# EAGLE design easyMySens-Std-V02-v035 (EAGLE 7.6.0)
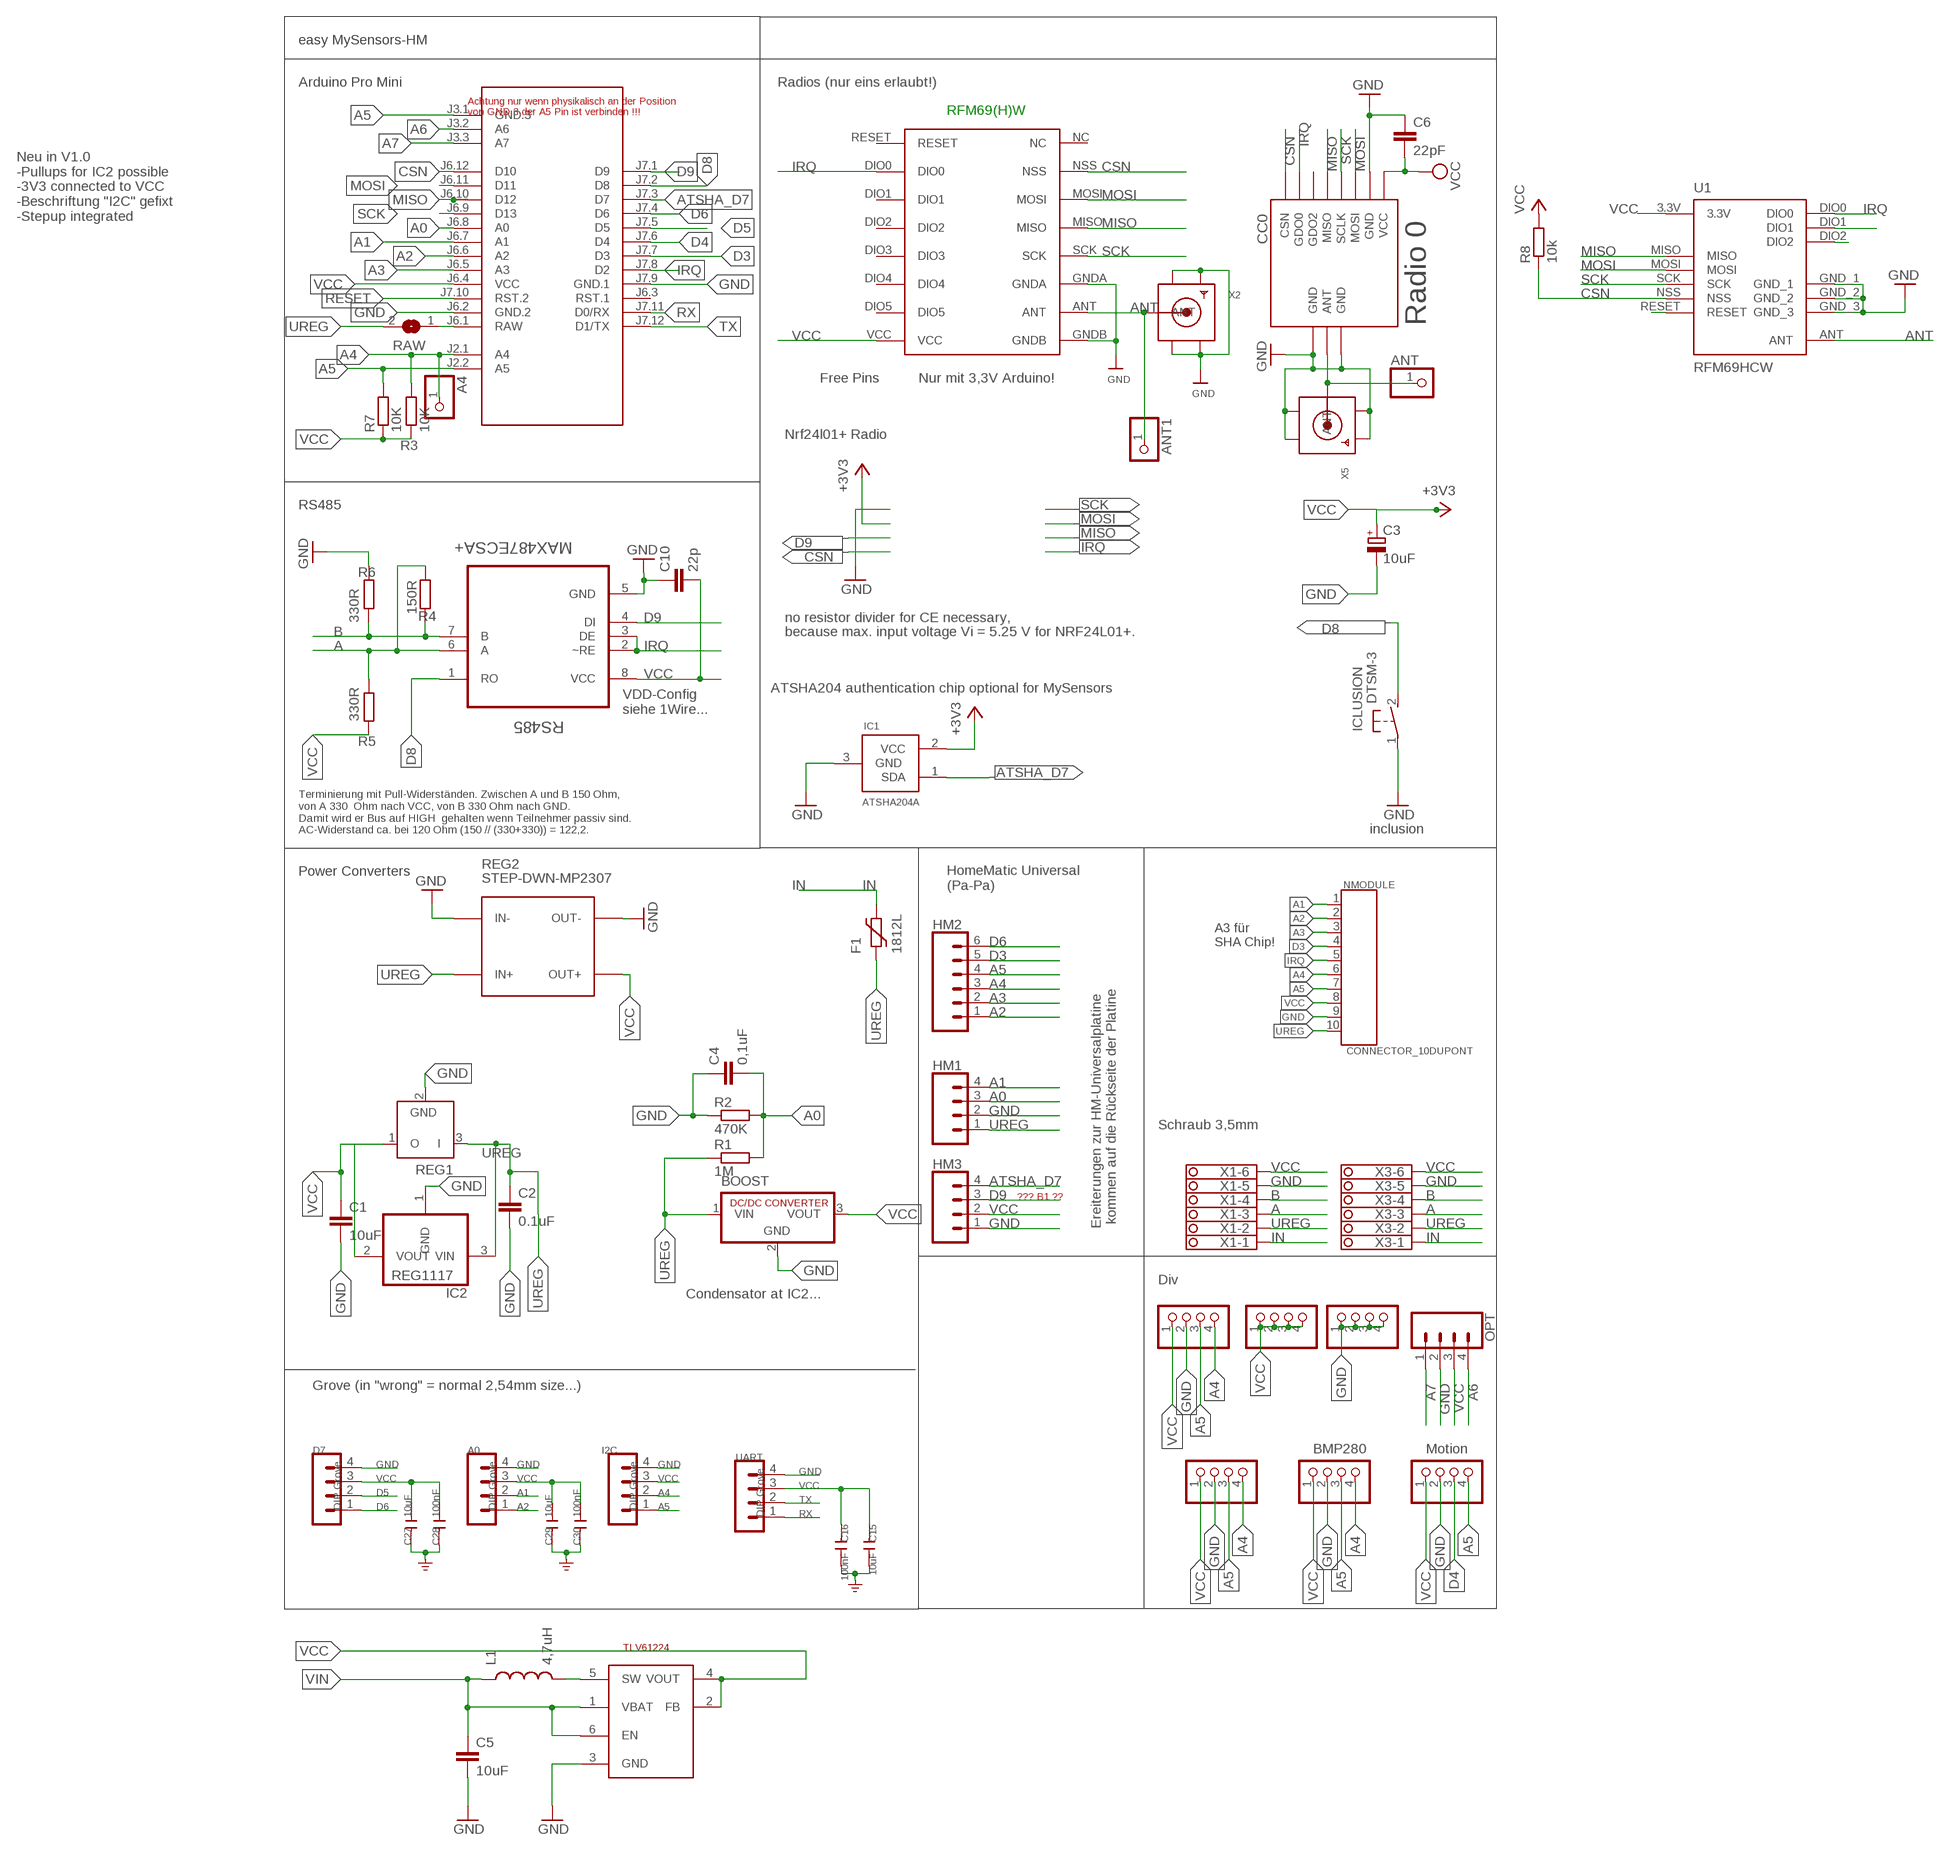
[diagram p0: schematic, sheet 1]

## Parts
A0  DIP Grove  MA04-1  [MA04-1]
A4  PINHD-1X1  [1X01]
ANT  PINHD-1X1  [1X01]
ANT1  PINHD-1X1  [1X01]
BH1750  PINHD-1X04_2.54-S  [1X04-S]
BOOST  R-78C1.8-1.0  [SIP3]
C1  10uF  C-EUC1210  [C1210]
C2  0.1uF  C-EUC1206  [C1206]
C3  10uF  CPOL-EUSMCC  [SMC_C]
C4  0,1uF  C-EUC1206  [C1206]
C5  10uF  CAP0805  [0805]
C6  22pF  C-EUC0805  [C0805]
C10  22p  C-EUC0805  [C0805]
C15  10uF  CAP-0603  [C0603]
C16  100nF  CAP-0603  [C0603]
C27  10uF  CAP-0603  [C0603]
C28  100nF  CAP-0603  [C0603]
C29  10uF  CAP-0603  [C0603]
C30  100nF  CAP-0603  [C0603]
CC0  CC1101  CC1101_MODULE1SMD  [CC1101_MODULE1_SMD]
D7  DIP Grove  MA04-1  [MA04-1]
F1  1812L  [1812L]
HM1  CONN_04  [1X04]
HM2  CONN_06SILK_FEMALE_PTH  [1X06]
HM3  CONN_04  [1X04]
I2C-1  PINHD-1X04_2.54-S  [1X04-S]
I2C-2  PINHD-1X04_2.54-S  [1X04-S]
I2C.  DIP Grove  MA04-1  [MA04-1]
IC1  ATSHA204A  [SOT23]
IC2  REG1117  [SOT223]
ICLUSION  DTSM-3  [DTSM-3]
JP1  PINHD-1X04_2.54-S  [1X04-S]
JP3  PINHD-1X04_2.54-S  [1X04-S]
L1  4,7uH  INDUCTOR0805  [0805]
M1  ARDUINO-PRO-MINI-3.3V#NP  [ARDUINO-PRO-MINI#NP]
MOTION  PINHD-1X04_2.54-S  [1X04-S]
NMODULE  CONNECTOR_10DUPONT  [DUPONT_10]
OPT  CONN_04  [1X04]
R1  1M  R-EU_R0805  [R0805]
R2  470K  R-EU_R0805  [R0805]
R3  10K  R-EU_R0805  [R0805]
R4  150R  R-EU_R0805  [R0805]
R5  330R  R-EU_R0805  [R0805]
R6  330R  R-EU_R0805  [R0805]
R7  10K  R-EU_R0805  [R0805]
R8  10k  R-EU_M0805  [M0805]
RAW  SJ  [SJ]
REG1  LP2950Z  [TO92]
REG2  STEP-DWN-MP2307  DC-DC-STEP-DOWN-MP2307  [DC-DC-STEP-DOWN-MP2307]
RFM69W  RFM69HW  [RFM]
RS485  MAX487ECSA+  [SOIC127P600X175-8N]
STEPUP  TLV61224  TI-TLV61224  [SOT23-6L]
U1  RFM69HCW  [RFM69HCW-XXXS2]
UART  DIP Grove  MA04-1  [MA04-1]
X1  1751280  [1751280]
X2  SMACONNECTOR_EDGE  [SMA_EDGELAUNCH]
X3  1751280  [1751280]
X5  SMACONNECTOR_EDGE  [SMA_EDGELAUNCH]

## Nets
3.3V [Power]: IC1.2(VCC) ; supply symbol labelled +3V3
A: R4.1 R5.2 RS485.6(A) X1.3 X3.3
A0: C4.2 HM1.3 M1.J6.8(A0) R1.2 R2.2
A1: A0.2 HM1.4 M1.J6.7(A1) NMODULE.1
A2: A0.1 HM2.1 M1.J6.6(A2) NMODULE.2
A3: HM2.2 M1.J6.5(A3) NMODULE.3
A4: A4.1 BH1750.4 HM2.3 I2C-1.4 I2C-2.4 I2C..2 M1.J2.1(A4) NMODULE.6 R3.2
A5: BH1750.3 HM2.4 I2C-1.3 I2C-2.3 I2C..1 M1.J2.2(A5) M1.J3.1(GND.3) MOTION.4 NMODULE.7 R7.2
A6: M1.J3.2(A6) OPT.4
A7: M1.J3.3(A7) OPT.1
ANT: ANT1.1 RFM69W.ANT U1.ANT X2.P(ANT)
ANT0: ANT.1 CC0.ANT X5.P(ANT)
ATSHA_D7: HM3.4 IC1.1(SDA) M1.J7.3(D7)
B: R4.2 R6.1 RS485.7(B) X1.4 X3.4
CSN: CC0.CSN M1.J6.12(D10) R8.1 RFM69W.NSS U1.NSS
D3: HM2.5 M1.J7.7(D3) NMODULE.4
D4: M1.J7.6(D4) MOTION.3
D5: D7.2 M1.J7.5(D5)
D6: D7.1 HM2.6 M1.J7.4(D6)
D8: ICLUSION.2 M1.J7.2(D8) RS485.1(RO)
D9: HM3.3 M1.J7.1(D9) RS485.4(DI)
GND [Power]: A0.4 BH1750.2 BOOST.2(GND) C1.2 C2.2 C3.- C4.1 C5.2 C6.1 C10.1 C15.1 C16.1 C27.2 C28.2 C29.2 C30.2 CC0.GND@0(GND) CC0.GND@1(GND) CC0.GND@2(GND) D7.4 HM1.2 HM3.1 I2C-1.2 I2C-2.2 I2C..4 IC1.3(GND) IC2.1(GND) ICLUSION.1 JP1.1 JP1.2 JP1.3 JP1.4 M1.J6.2(GND.2) M1.J7.9(GND.1) MOTION.2 NMODULE.9 OPT.2 R2.1 R6.2 REG1.2(GND) REG2.IN- REG2.OUT- RFM69W.GNDA RFM69W.GNDB RS485.5(GND) STEPUP.3(GND) U1.GND_1 U1.GND_2 U1.GND_3 UART.4 X1.5 X2.GND@1(GND4) X2.GND@2(GND3) X2.GND@3(GND2) X2.GND@4(GND1) X3.5 X5.GND@1(GND4) X5.GND@2(GND3) X5.GND@3(GND2) X5.GND@4(GND1) ; supply symbol labelled GND_POWER
IN [Power]: F1.P$2 X1.1 X3.1
IRQ: CC0.GDO0 M1.J7.8(D2) NMODULE.5 RFM69W.DIO0 RS485.2(~RE) RS485.3(DE) U1.DIO0
MISO: CC0.MISO M1.J6.10(D12) RFM69W.MISO U1.MISO
MOSI: CC0.MOSI M1.J6.11(D11) RFM69W.MOSI U1.MOSI
N$1: U1.RESET
N$13: L1.2 STEPUP.5(SW)
N$14: U1.DIO2
N$15: U1.DIO1
RAW [Power]: M1.J6.1(RAW) RAW.1
RESET: M1.J7.10(RST.2)
RX: M1.J7.11(D0/RX) UART.1
SCK: CC0.SCLK M1.J6.9(D13) RFM69W.SCK U1.SCK
TX: M1.J7.12(D1/TX) UART.2
UREG [Power]: BOOST.1(VIN) C2.1 F1.P$1 HM1.1 IC2.3(VIN) NMODULE.10 R1.1 RAW.2 REG1.3(I) REG2.IN+ X1.2 X3.2
VCC [Power]: A0.3 BH1750.1 BOOST.3(VOUT) C1.1 C3.+ C6.2 C10.2 C15.2 C16.2 C27.1 C28.1 C29.1 C30.1 CC0.VCC D7.3 HM3.2 I2C-1.1 I2C-2.1 I2C..3 IC2.2(VOUT) JP3.1 JP3.2 JP3.3 JP3.4 M1.J6.4(VCC) MOTION.1 NMODULE.8 OPT.3 R3.1 R5.1 R7.1 R8.2 REG1.1(O) REG2.OUT+ RFM69W.VCC RS485.8(VCC) STEPUP.2(FB) STEPUP.4(VOUT) U1.3.3V UART.3 X1.6 X3.6 ; supply symbol labelled +3V3
VIN: C5.1 L1.1 STEPUP.1(VBAT) STEPUP.6(EN)
Unconnected: CC0.GDO2 M1.J6.3(RST.1) RFM69W.DIO1 RFM69W.DIO2 RFM69W.DIO3 RFM69W.DIO4 RFM69W.DIO5 RFM69W.NC RFM69W.RESET

## Notes on the sheet
- easy MySensors-HM
- Arduino Pro Mini | Radios (nur eins erlaubt!)
- Achtung nur wenn physikalisch an der Position 
  von GND.3 der A5 Pin ist verbinden !!!
- RFM69(H)W
- Neu in V1.0
  -Pullups for IC2 possible
  -3V3 connected to VCC
  -Beschriftung "I2C" gefixt
  -Stepup integrated
- Radio 0
- Free Pins | Nur mit 3,3V Arduino!
- Nrf24l01+ Radio
- RS485
- no resistor divider for CE necessary,
- because max. input voltage Vi = 5.25 V for NRF24L01+.
- ATSHA204 authentication chip optional for MySensors
- VDD-Config
  siehe 1Wire...
- Terminierung mit Pull-Widerständen. Zwischen A und B 150 Ohm,
  von A 330  Ohm nach VCC, von B 330 Ohm nach GND. 
  Damit wird er Bus auf HIGH  gehalten wenn Teilnehmer passiv sind.
  AC-Widerstand ca. bei 120 Ohm (150 // (330+330)) = 122,2.
- inclusion
- Power Converters
- HomeMatic Universal
  (Pa-Pa)
- A3 für 
  SHA Chip!
- Schraub 3,5mm
- ??? B1 ??
- Ereiterungen zur HM-Universalplatine
   kommen auf die Rückseite der Platine
- Div
- Condensator at IC2...
- Grove (in "wrong" = normal 2,54mm size...)
- BMP280 | Motion

## Library data of the parts
A0 D7 I2C. UART = con-lstb:MA04-1: PIN HEADER; OC_FARNELL: unknown; OC_NEWARK: unknown
A4 ANT ANT1 = pinhead:PINHD-1X1: PIN HEADER
BH1750 I2C-1 I2C-2 JP1 JP3 MOTION = pinhead-2:PINHD-1X04: PIN HEADER
BOOST = dc-dc-converter:R-78C*-1.0: INNOLINE DC/DC-Converter 1.0 AMP SIP3 Single Output Source: Data sheet <http://www.mikrocontroller.net/attachment/150645/157764-da-01-en-DC_DC_WANDLER_R_78C5_0_1_0.pdf>
C1 C2 C4 C6 C10 = rcl:C-EU: CAPACITOR, European symbol
C3 = rcl:CPOL-EU: POLARIZED CAPACITOR, European symbol
C5 = SparkFun-Passives:CAP: Capacitor Standard 0603 ceramic capacitor, and 0.1" leaded capacitor.
C15 C16 C27-C30 = Discrete-new:CAP: Ceramic Capacitors
CC0 = wireless:CC1101_MODULE1: CC1101 wireless module for 433/868 MHz (sold from Aliexpress). DIL version for mounting with pin header (and SMD soldering) and SMD only variant available.
F1 = ptc-littlefuse:1812L
HM1 HM3 OPT = SparkFun-Connectors:CONN_04: Multi connection point. Often used as Generic Header-pin footprint for 0.1 inch spaced/style header connections On any of the 0.1 inch spaced packages, you can populate with these: Break Away Headers - Straight <https://www.sparkfun.com/products/116> (PRT-00116) Break Away Male Headers - Right Angle <https://www.sparkfun.com/products/553> (PRT-00553) Female Headers <https://www.sparkfun.com/products/115> (PRT-00115) Break Away Headers - Machine Pin <https://www.sparkfun.com/products/117> (PRT-00117) Break Away Female Headers - Swiss Machine Pin <https://www.sparkfun.com/products/743> (PRT-00743) For SCREWTERMINALS and SPRING TERMINALS visit here: Screw Terimnals on SparkFun.com <https://www.sparkfun.com/search/results?term=Screw+Terminals> (5mm/3.5mm/2.54mm spacing) This device is also useful as a general connection point to wire up your design to another part of your project. Our various solder wires solder well into these plated through hole pads. Hook-Up Wire - Assortment (Stranded, 22 AWG) <https://www.sparkfun.com/products/11375> (PRT-11375) Hook-Up Wire - Assortment (Solid Core, 22 AWG) <https://www.sparkfun.com/products/11367> (PRT-11367) View the entire wire category on our website here <https://www.sparkfun.com/categories/141> Special notes: Molex polarized connector foot print use with SKU : PRT-08231 with associated crimp pins and housings. 1MM SMD Version SKU: PRT-10208; PROD_ID: CONN-09696
HM2 = SparkFun-Connectors:CONN_06: Multi connection point. Often used as Generic Header-pin footprint for 0.1 inch spaced/style header connections On any of the 0.1 inch spaced packages, you can populate with these: Break Away Headers - Straight <https://www.sparkfun.com/products/116> (PRT-00116) Break Away Male Headers - Right Angle <https://www.sparkfun.com/products/553> (PRT-00553) Female Headers <https://www.sparkfun.com/products/115> (PRT-00115) Break Away Headers - Machine Pin <https://www.sparkfun.com/products/117> (PRT-00117) Break Away Female Headers - Swiss Machine Pin <https://www.sparkfun.com/products/743> (PRT-00743) Arduino Stackable Header - 6 Pin <https://www.sparkfun.com/products/9280> (PRT-09280) For SCREWTERMINALS and SPRING TERMINALS visit here: Screw Terimnals on SparkFun.com <https://www.sparkfun.com/search/results?term=Screw+Terminals> (5mm/3.5mm/2.54mm spacing) This device is also useful as a general connection point to wire up your design to another part of your project. Our various solder wires solder well into these plated through hole pads. Hook-Up Wire - Assortment (Stranded, 22 AWG) <https://www.sparkfun.com/products/11375> (PRT-11375) Hook-Up Wire - Assortment (Solid Core, 22 AWG) <https://www.sparkfun.com/products/11367> (PRT-11367) View the entire wire category on our website here <https://www.sparkfun.com/categories/141>; PROD_ID: CONN-08437
IC1 = Sensor:ATSHA204A
IC2 = burr-brown:REG1117: 800mA and 1A Low Dropout (LDO) Positive Regulator 1.8V, 2.5V, 2.85V, 3.3V, 5V, and Adj; MPN: REG1117; OC_FARNELL: 1097566; OC_NEWARK: 14P6981
ICLUSION = mechanics:DTSM-3: Diptronics SMD button 6x3.5 mm
L1 = SparkFun-Passives:INDUCTOR: Inductors Basic Inductor/Choke - 0603 and 1206. Footprints are not proven and vary greatly between part numbers.
M1 = diy-modules:ARDUINO-PRO-MINI-*#NP: Arduino Pro Mini without programming pads
NMODULE = TD-MySensors:CONNECTOR_10
R1-R8 = rcl:R-EU_: RESISTOR, European symbol
RAW = jumper:SJ: SMD solder JUMPER
REG1 = linear:LP2950: 100 mA, Low Power Low Dropout Voltage Regulator Source: http://www.onsemi.com/pub/Collateral/LP2950-D.PDF
REG2 = diy-modules:DC-DC-STEP-DOWN-MP2307: DC/DC Step-Down Regulator based on MP2307DN chip MP2307 datasheet available here: https://cdn-shop.adafruit.com/datasheets/MP2307_r1.9.pdf Click here to find device on ebay.com <http://www.ebay.com/sch/dc+dc+3a+mini+converter>
RFM69W = hoperf:RFM69HW
RS485 = Maxim_By_element14_Batch_1:MAX487ECSA+: Low-Power, Slew-Rate-Limited RS-485/RS-422 Transceivers; MPN: MAX487ECSA+; OC_FARNELL: 9724532; OC_NEWARK: 68K4803; PACKAGE: SOIC-8; SUPPLIER: Maxim
STEPUP = TLV61224:TI-TLV61224
U1 = doug:RFM69H
X1 X3 = con-phoenix-350:1751280: MKDS 1/ 6-3,5 Printklemme Nennstrom: 10 A Bemessungsspannung: 160 V Raster: 3,5 mm Polzahl: 6 Montageart: Löten Anschlussart: Schraubanschluss Anschlussrichtung vom Leiter zur Platine: 0° Source: http://eshop.phoenixcontact.com .. 1751280.pdf; MPN: 1751280; OC_FARNELL: unknown; OC_NEWARK: 27R1765
X2 X5 = adafruit:SMACONNECTOR: SMA Connector 90° DIP SMA Connector, 50 Ohm (4UConnector: 07259)

## Net classes
0 default: width 0.305 mm
1 Power: width 0.508 mm

## Board
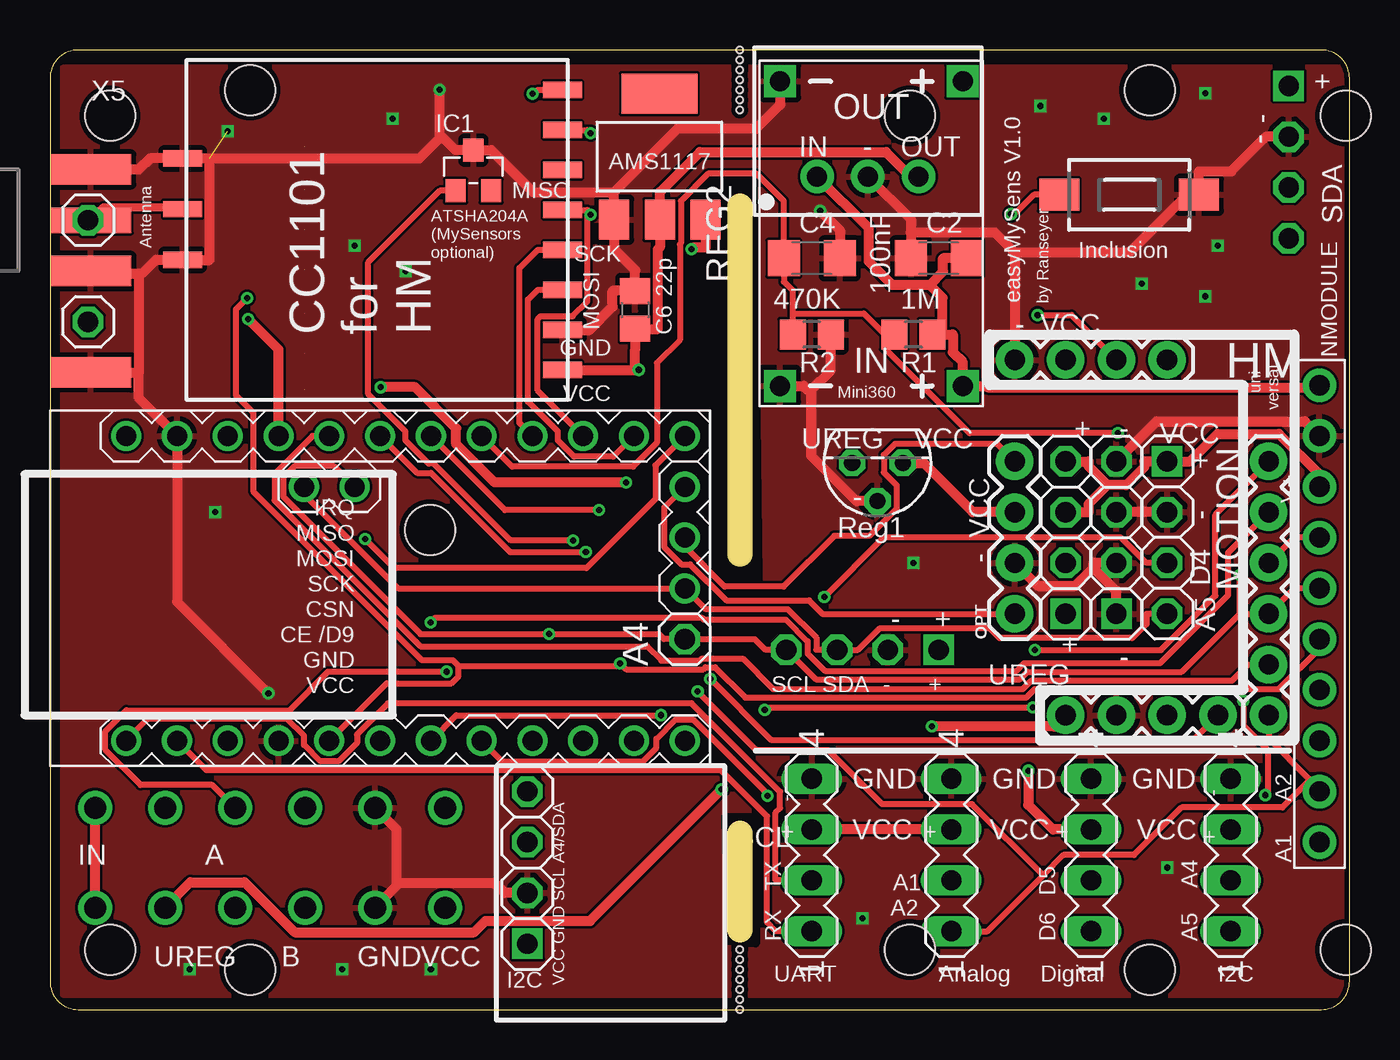
[diagram p1: board, top side]
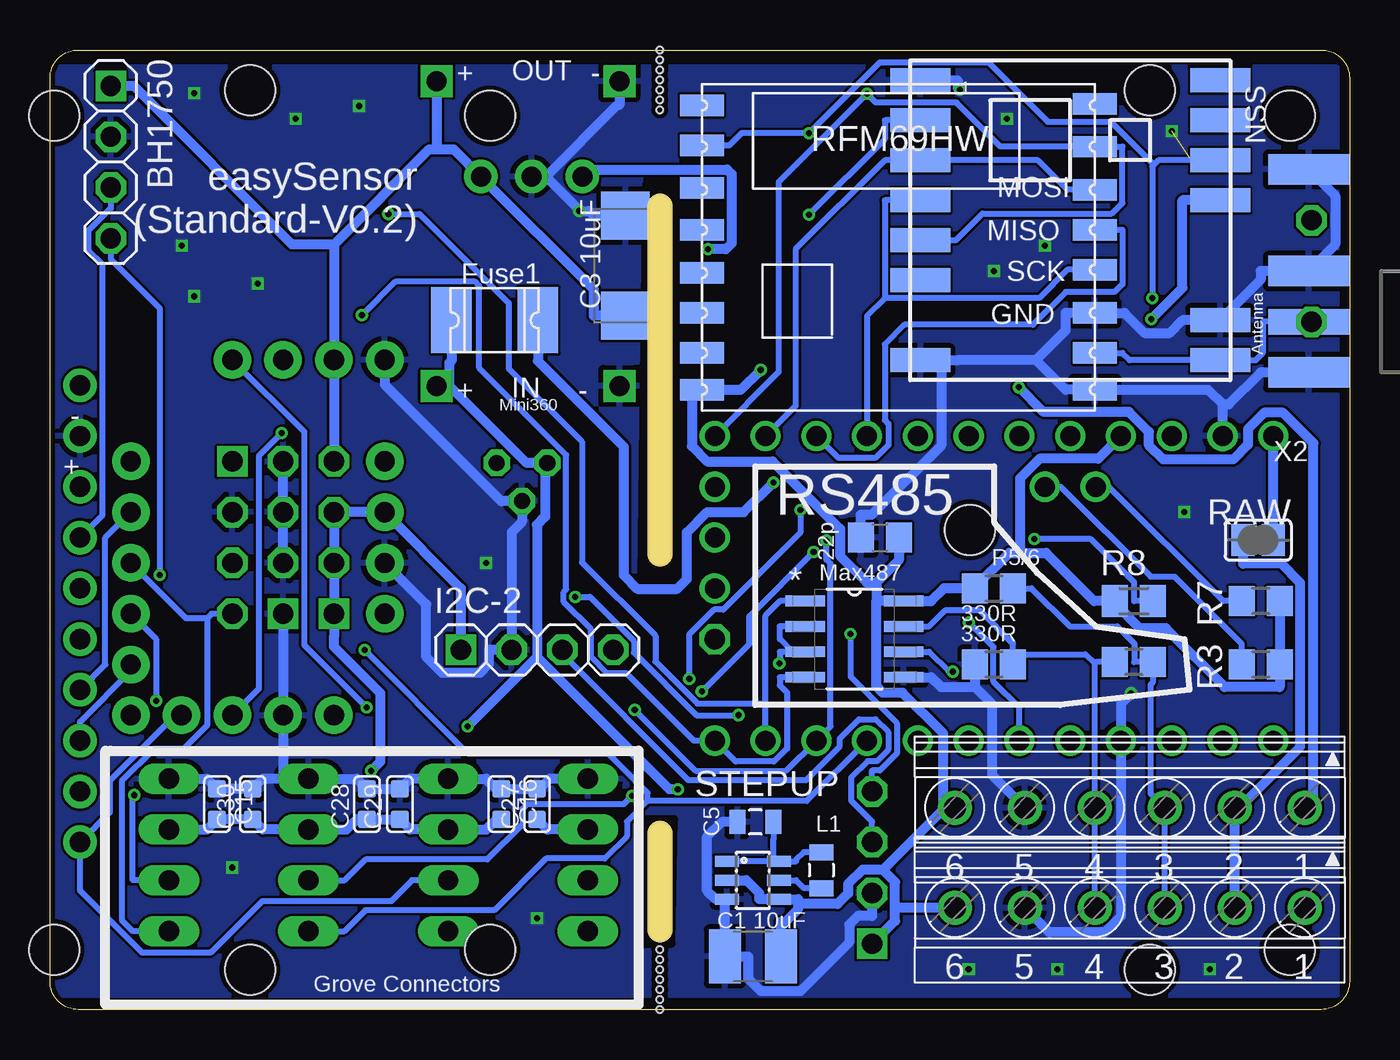
[diagram p2: board, bottom side, seen from below]

Size 65 x 48 mm. Coordinates in mm from the lower left corner, seen from the top.
Outline: 0,46.59 0,1.41 arc90 1.41,0 63.59,0 arc90 65,1.41 65,46.59 arc90 63.59,48 1.41,48 arc90 0,46.59
Copper layers (1*16): Top 0.035mm / dielectric 1.5mm / Bottom 0.035mm
Design rules "dirt_cheap_dirty_boards.v1": minimum track width 5mil, minimum drill 12mil, track to track 5mil, track to pad 5mil, pad to pad 5mil, via to via 5mil, smd to smd 0mil, copper to edge 10mil, drill to drill 10mil, minimum pad ring 10mil, minimum via ring 6mil, stop-mask expansion 2mil, vias tented up to drill 25mil, thermal gap 10mil
Holes 2.5 mm at 19,24 3,3 3,44.7 64.8,44.7 43,3 64.8,3 43,44.7 10,2 55,2 10,46 55,46
Holes 0.3 mm at 34.5,3 34.5,2.5 34.5,2 34.5,1.5 34.5,1 34.5,0.5 34.5,45 34.5,45.5 34.5,46 34.5,46.5 34.5,47 34.5,47.5 34.5,48 34.5,0
tRestrict: area 33.8,21.6 to 35.4,41.4; area 33.8,3.3 to 35.3,9.6; 2 lines
bRestrict: area 33.8,21.6 to 35.4,41.3; area 33.8,3.3 to 35.4,9.5; 2 lines
Milling: 2 lines

### Footprints (pad centres in the part's own frame; a part is rotated, then mirrored left to right if it is on the bottom)
MA04-1 = drill 1.016 long: 1 -3.81,0; 2 -1.27,0; 3 1.27,0; 4 3.81,0
1X01 = drill 1.016 octagon: 1 0,0
1X04-S = drill 1.016 square: 1 -3.81,0 | drill 1.016 octagon: 2 -1.27,0; 3 1.27,0; 4 3.81,0
SIP3 = drill 1 pad 1.676: 1 -2.54,0; 2 0,0; 3 2.54,0
C1210 = smd 1.6 x 2.7: 1 -1.4,0; 2 1.4,0
C1206 = smd 1.6 x 1.8: 1 -1.4,0; 2 1.4,0
SMC_C = smd 2.4 x 2.4: + -2.5,0; - 2.5,0
0805 = smd 0.8 x 1.2: 1 -0.9,0; 2 0.9,0
C0805 = smd 1.3 x 1.5: 1 -0.95,0; 2 0.95,0
C0603 = smd 0.889 x 0.889: 1 0,0.762; 2 0,-0.762
CC1101_MODULE1_SMD = smd 1.93 x 0.813: ANT 19,5.96; CSN 0,0; GDO0 0,2; GDO2 0,4; GND@0 0,12; GND@1 19,8.5; GND@2 19,3.42; MISO 0,6; MOSI 0,10; SCLK 0,8; VCC 0,14
1812L = smd 2.03 x 3.3: P$1 -2.16,0; P$2 2.16,0
1X04 = drill 1.016 pad 1.88: 1 0,0; 2 2.54,0; 3 5.08,0; 4 7.62,0
1X06 = drill 1.016 pad 1.88: 1 0,0; 2 2.54,0; 3 5.08,0; 4 7.62,0; 5 10.16,0; 6 12.7,0
SOT23 = smd 1.016 x 1.143: 1 -0.889,-1.016; 2 0.889,-1.016; 3 0,1.016
SOT223 = smd 1.499 x 2.007: 1 -2.261,-3.15; 2 0.025,-3.15; 3 2.311,-3.15 | smd 3.81 x 2.007: 4 0,3.15
DTSM-3 = smd 2 x 1.6: 1 -3.494,0; 2 3.494,0
ARDUINO-PRO-MINI#NP = drill 1: J2.1 -1.27,5.08; J2.2 -3.81,5.08; J3.1 15.24,0; J3.2 15.24,2.54; J3.3 15.24,5.08; J6.1 -12.7,7.62; J6.2 -10.16,7.62; J6.3 -7.62,7.62; J6.4 -5.08,7.62; J6.5 -2.54,7.62; J6.6 0,7.62; J6.7 2.54,7.62; J6.8 5.08,7.62; J6.9 7.62,7.62; J6.10 10.16,7.62; J6.11 12.7,7.62; J6.12 15.24,7.62; J7.1 15.24,-7.62; J7.2 12.7,-7.62; J7.3 10.16,-7.62; J7.4 7.62,-7.62; J7.5 5.08,-7.62; J7.6 2.54,-7.62; J7.7 0,-7.62; J7.8 -2.54,-7.62; J7.9 -5.08,-7.62; J7.10 -7.62,-7.62; J7.11 -10.16,-7.62; J7.12 -12.7,-7.62
DUPONT_10 = drill 1.016 pad 1.676: 1 1.27,1.27; 2 3.81,1.27; 3 6.35,1.27; 4 8.89,1.27; 5 11.43,1.27; 6 13.97,1.27; 7 16.51,1.27; 8 19.05,1.27; 9 21.59,1.27; 10 24.13,1.27
R0805 = smd 1.3 x 1.5: 1 -0.95,0; 2 0.95,0
M0805 = smd 1.3 x 1.6: 1 -0.95,0; 2 0.95,0
SJ = smd 1.168 x 1.6: 1 -0.762,0; 2 0.762,0
TO92 = drill 0.813 octagon: 1 -1.27,0; 2 0,1.905; 3 1.27,0
DC-DC-STEP-DOWN-MP2307 = drill 1 pad 1.6 square: IN+ -7.62,-4.572; IN- -7.62,4.572; OUT+ 7.62,-4.572; OUT- 7.62,4.572
RFM = smd 2.184 x 1.067: ANT 19.651,2.889; DIO0 0,13.27; DIO1 0,11.143; DIO2 0,9.047; DIO3 0,6.889; DIO4 0,4.889; DIO5 0,2.889; GNDA 19.651,4.889; GNDB 19.651,1.048; MISO 19.651,9.047; MOSI 19.651,11.047; NC 19.651,15.334; NSS 19.651,13.206; RESET 0,15.27; SCK 19.651,7.048; VCC 0,1.048
SOIC127P600X175-8N = smd 1.981 x 0.533: 1 -2.464,1.905; 2 -2.464,0.635; 3 -2.464,-0.635; 4 -2.464,-1.905; 5 2.464,-1.905; 6 2.464,-0.635; 7 2.464,0.635; 8 2.464,1.905
SOT23-6L = smd 0.55 x 1.2: 1 -0.95,-1.3; 2 0,-1.3; 3 0.95,-1.3; 4 0.95,1.3; 5 0,1.3; 6 -0.95,1.3
RFM69HCW-XXXS2 = smd 3 x 1.2: 3.3V 7.5,1; ANT 7.5,-7; DIO0 7.5,3; DIO1 7.5,5; DIO2 7.5,7; GND_1 7.5,-5; GND_2 -7.5,-7; GND_3 -7.5,7; MISO -7.5,5; MOSI -7.5,3; NSS -7.5,-1; RESET -7.5,-3; SCK -7.5,1
1751280 = drill 1.1 pad 1.7: 1 -8.75,-0.1; 2 -5.25,-0.1; 3 -1.75,-0.1; 4 1.75,-0.1; 5 5.25,-0.1; 6 8.75,-0.1
SMA_EDGELAUNCH = smd 4.064 x 1.524: GND@1 2.032,-2.54; GND@2 2.032,2.54 | smd 4.064 x 1.524 bottom: GND@3 2.032,2.54; GND@4 2.032,-2.54 | smd 4.064 x 1.27: P 2.032,0

### Placement (x,y rotation side)
A0  45.09,7.73 90 top
A4  31.75,18.53 90 top
ANT  1.91,39.48 0 top
ANT1  1.91,34.41 0 top
BH1750  61.96,42.39 270 bottom
BOOST  40.91,41.67 0 top
C1  29.84,2.66 180 bottom
C2  44.45,37.58 180 top
C3  36.23,37.21 90 bottom
C4  38.1,37.58 180 top
C5  29.72,9.39 180 bottom
C6  29.27,35 270 top
C10  23.5,23.61 0 bottom
C15  56.64,10.27 0 bottom
C16  42.42,10.27 0 bottom
C27  40.64,10.27 180 bottom
C28  49.15,10.27 180 bottom
C29  47.5,10.27 180 bottom
C30  54.86,10.27 180 bottom
CC0  25.64,46 180 top
D7  52.07,7.73 90 top
F1  42.76,34.48 0 bottom
HM1  50.8,14.72 0 top
HM2  60.96,14.72 90 top
HM3  48.26,32.5 0 top
I2C-1  23.88,7.1 90 top
I2C-2  40.64,17.99 0 bottom
I2C.  59.05,7.73 90 top
IC1  21.18,41.97 0 top
IC2  30.48,42.66 0 top
ICLUSION  53.98,40.75 180 top
JP1  53.34,23.61 90 top
JP3  50.8,23.61 90 top
L1  26.42,6.97 270 bottom
M1  16.51,21.07 0 top
MOTION  55.88,23.61 270 top
NMODULE  64.77,7.1 90 top
OPT  48.26,19.8 90 top
R1  43.18,33.77 180 top
R2  38.1,33.77 180 top
R3  4.45,17.26 180 bottom
R4  10.79,17.39 180 bottom
R5  17.78,21.07 0 bottom
R6  17.78,17.26 180 bottom
R7  4.45,20.44 180 bottom
R8  10.79,20.44 180 bottom
RAW  4.57,23.48 180 bottom
REG1  41.39,27.34 180 top
REG2  41.09,38.81 90 top
RFM69W  32.38,29.96 0 bottom
RS485  24.77,18.53 0 bottom
STEPUP  29.84,6.47 270 bottom
U1  13.97,39.48 0 bottom
UART  38.1,7.73 90 top
X1  11,10 180 bottom
X2  0,34.41 180 bottom
X3  11,5 180 bottom
X5  0,39.48 0 top

### Tracks (layer width: path | path; a pad name or v marks a point on that pad's centre or on a via)
A  (via drill 0.3 pad 0.61)
  Top 0.305: X1.3 8.12,11.23 4.53,11.23 2.77,12.99 2.77,13.92 3.81,14.97 11.97,14.97 13.91,16.9 v19.84,16.9
  Bottom 0.305: v19.84,16.9 20.04,16.9 21.03,17.9 RS485.6 | R5.2 15.9,21.07 13.99,19.16 11.62,19.16 10.77,18.32 10.77,17.39 R4.1 9.85,16.36 9.94,16.26 9.94,10.79 X1.3 X3.3
A0  (via drill 0.3 pad 0.61)
  Top 0.305: M1.J6.8 23.12,27.16 29.16,27.16 30.36,28.35 30.36,32.36 31.5,33.5 31.5,38.28 31.55,38.33 31.55,40.44 32.91,41.8 35.34,41.8 36.7,40.44 C4.2 36.7,36.4 37.15,35.95 37.15,34.82 | R2.2 37.15,34.82 | 37.15,34.82 40.71,34.82 41.77,33.77 | v53.42,28.84 45.99,28.84 41.77,33.06 41.77,33.77 | R1.2 41.77,33.77
  Bottom 0.305: v53.42,28.84 54.56,27.69 54.56,16.04 HM1.3
A1  (via drill 0.3 pad 0.61)
  Top 0.305: HM1.4 57.17,13.47 36.09,13.47 v33.02,16.54 | v27.47,24.98 22.76,24.98 M1.J6.7
  Bottom 0.305: v27.47,24.98 27.47,23.86 31.32,20 31.78,20 33.02,18.76 v33.02,16.54 | HM1.4 58.73,14.72 61.99,11.46 61.99,9.88 NMODULE.1 63.5,5.95 60.39,2.84 56.96,2.84 54.38,5.42 47.93,5.42 46.89,6.47 A0.2
A2  (via drill 0.3 pad 0.61)
  Top 0.305: M1.J6.6 18.36,26.84 19.06,26.84 23.01,22.88 v26.8,22.88 | 49.68,6.72 46.12,10.27 41.63,10.27 38.94,12.97 35.34,12.97 v32.4,15.91 | 49.68,6.72 46.89,3.92 A0.1 | 62.97,11.44 61.64,10.11 56.59,10.11 54.22,7.73 50.7,7.73 49.68,6.72 | HM2.1 60.96,13.56 62.97,11.54 62.97,11.44 | 62.97,11.44 | NMODULE.2 62.97,11.44
  Bottom 0.305: v32.4,15.91 30.02,18.28 30.02,19.66 v26.8,22.88
A3
  Top 0.305: M1.J6.5 13.13,28.69 11.23,26.79 11.23,25.47 18.53,18.17 29.87,18.17 30.59,17.45 32.51,17.45 32.6,17.55 34.65,17.55 36.17,16.04 48.65,16.04 49.08,16.46 59.13,16.46 59.93,17.26 HM2.2
  Bottom 0.305: NMODULE.3 63.5,14.39 60.96,16.93 HM2.2
A4  (via drill 0.3 pad 0.61)
  Top 0.305: 59.52,19.8 v59.52,21.74 | 59.52,19.8 56.61,16.89 48.9,16.89 48.52,16.52 38.3,16.52 I2C-2.4 35.79,17.99 35.25,18.53 A4.1 30.71,18.53 30.46,18.78 v24.96,18.78 18.53,18.78 11.66,25.65 11.66,26.62 12.23,27.19 14.2,27.19 M1.J2.1 | 59.52,19.8 HM2.3 62.23,21.07 NMODULE.6 | v59.69,15.45 59.69,14.22 60.91,13 60.91,10.85 v60.79,10.73
  Bottom 0.305: v59.52,21.74 59.52,35.1 61.96,37.54 BH1750.4 | v24.96,18.78 24.96,16.65 22.64,14.33 22.64,12.81 23.49,11.95 23.88,11.95 I2C-1.4 | HM2.3 59.69,18.53 v59.69,15.45 | v60.79,10.73 60.86,10.66 60.86,6.47 I2C..2 | M1.J2.1 14.44,26.15 9.94,21.65 8.76,21.65 5.39,18.29 R3.2
A5
  Top 0.305: M1.J2.2 12.7,25.77 17.41,21.07 M1.J3.1 32.79,20.03 36.9,20.03 38.33,18.6 38.33,17.99 I2C-2.3 40.41,17.99 41.48,19.06 47.01,19.06 47.49,18.58 54.14,18.58 54.84,19.28 54.84,19.8 MOTION.4 | NMODULE.7 62.23,23.61 HM2.4
  Bottom 0.305: BH1750.3 61.96,40.08 63.05,38.99 63.05,37.96 62.37,37.28 62.37,24.74 NMODULE.7 | I2C-1.3 23.88,9.41 24.93,10.46 24.93,11.6 24.11,12.42 23.65,12.42 23.07,12.99 23.07,13.88 23.71,14.52 24.53,14.52 25.49,13.55 25.49,13.17 27.17,11.49 33.08,11.49 39.37,17.78 I2C-2.3 | R7.2 6.32,20.44 12.04,26.15 M1.J2.2 | 57.15,19.57 57.15,14.21 58.31,13.04 59.79,13.04 61.4,11.43 61.4,4.47 60.86,3.92 I2C..1 | 57.15,19.57 56.92,19.8 MOTION.4 | 57.15,19.57 58.19,19.57 HM2.4
A6
  Top 0.305: OPT.4 47.39,28.29 42.26,28.29 41.71,27.74 41.71,26.87 42.34,26.23 42.34,25.05 40.99,23.69 39.23,23.69 36.69,21.16 33.74,21.16 31.75,23.15 M1.J3.2
A7
  Top 0.305: M1.J3.3 30.72,25.12 30.72,23.14 31.58,22.27 32.02,22.27 33.83,20.46 37.97,20.46 38.63,19.8 OPT.1
ANT  (1 unrouted)
  Bottom 0.305: ANT1.1 X2.P 4.34,34.41 4.34,32.83 4.69,32.48 U1.ANT 11,32.48 11.36,32.85 RFM69W.ANT
ANT0
  Top 0.305: X5.P ANT.1
  Top 0.406: CC0.ANT arc90 6.55,40.12 5.08,40.12 2.67,40.12 X5.P
ATSHA_D7  (via drill 0.3 pad 0.61)
  Top 0.305: IC1.1 19.5,40.96 15.92,37.38 15.92,30.78 17.78,28.92 17.78,28.47 18.94,27.31 19.2,27.31 23.04,23.47 v26.16,23.47 | v35.75,14.99 35.87,15.11 v49.16,15.11
  Bottom 0.305: v26.16,23.47 26.16,22.51 25.96,22.3 25.96,14.16 M1.J7.3 28.18,11.94 32.7,11.94 v35.75,14.99 | v26.16,23.47 | HM3.4 52.29,28.91 52.29,18.23 v49.16,15.11
B
  Bottom 0.305: 12.75,17.31 12.68,17.39 R4.2 | 12.75,17.31 X1.4 X3.4 | 16.83,17.77 13.21,17.77 12.75,17.31 | 16.83,17.77 16.83,18.29 18.49,19.95 20.25,19.95 21.03,19.16 RS485.7 | R6.1 16.83,17.77
CSN  (via drill 0.3 pad 0.61)  (1 unrouted)
  Top 0.305: M1.J6.12 30.28,27.22 30.28,25.53 26.83,22.08 17.22,22.08 v15.77,23.53 | CC0.CSN 24.39,46 24.2,45.81 v24.14,45.81
  Bottom 0.305: v15.77,23.53 12.94,23.53 10.77,21.36 10.77,20.44 R8.1 | U1.NSS 19.69,38.48 18.36,39.82 11.89,39.82 11.36,40.35 11.36,43.17 RFM69W.NSS 17.46,43.17 19.66,45.36 23.7,45.36 v24.14,45.81 28.55,41.39 28.55,31.89 M1.J6.12
D3  (via drill 0.3 pad 0.61)
  Top 0.305: v19.03,19.37 19.27,19.6 32.6,19.6 32.7,19.51 36.81,19.51 37.9,18.42 37.9,17.81 38.76,16.95 48.34,16.95 48.72,17.33 55.53,17.33 58.93,20.73 58.93,22.85 HM2.5
  Bottom 0.305: M1.J7.7 16.51,15.1 17.8,16.39 17.8,18.13 v19.03,19.37 | NMODULE.4 62.23,17.26 62.23,23.61 HM2.5
D4  (via drill 0.3 pad 0.61)
  Top 0.305: M1.J7.6 20.32,14.72 v30.56,14.72 | MOTION.3 54.84,22.34 53.57,23.61 41.7,23.61 v38.73,20.64
  Bottom 0.305: v38.73,20.64 37.99,20.64 35.79,18.44 35.79,17.86 32.65,14.72 v30.56,14.72
D5  (via drill 0.3 pad 0.61)
  Top 0.305: M1.J7.5 22.62,12.42 29.66,12.42 30.33,13.09 30.33,13.55 31.29,14.51 32.16,14.51 35.89,10.78 v35.89,10.69
  Bottom 0.305: D7.2 50.27,6.47 49.23,7.51 43.13,7.51 41.37,9.27 41.37,10.04 41.14,10.27 36.31,10.27 v35.89,10.69
D6  (via drill 0.3 pad 0.61)
  Top 0.305: v49.26,17.98 55.58,17.98 58.29,20.7 58.29,24.75 HM2.6
  Bottom 0.305: 35.11,10.43 36.14,9.39 36.14,8.67 37.26,7.56 40.18,7.56 42.77,4.97 49.23,4.97 50.27,3.92 D7.1 | M1.J7.4 27.15,10.43 35.11,10.43 | 35.11,10.43 35.11,10.83 37.08,12.79 44.08,12.79 v49.26,17.98
D8  (via drill 0.3 pad 0.61)
  Top 0.305: ICLUSION.2 49.2,40.75 48.25,39.8 v48.08,39.8
  Bottom 0.305: 29.21,15.31 29.21,19.72 28.5,20.44 RS485.1 | M1.J7.2 29.21,15.31 | v48.08,39.8 46.52,39.8 42.06,35.34 42.06,32.07 38.39,28.4 38.39,22.37 34.72,18.7 34.72,17.41 32.62,15.31 29.21,15.31
D9  (via drill 0.3 pad 0.61)
  Top 0.305: v49.4,34.75 51.09,34.75 HM3.3
  Bottom 0.305: v49.4,34.75 47.74,36.41 43.74,36.41 43.53,36.2 43.53,32.09 39.18,27.74 39.18,21.02 39.31,20.88 39.31,20.4 37.95,19.03 37.95,17.63 37.14,16.82 36.17,16.82 32.8,13.45 M1.J7.1 30.71,12.41 28.79,12.41 28.14,13.06 28.14,15.85 28.5,16.22 28.5,16.62 RS485.4
GND  (via drill 0.3 pad 0.61)  (3 unrouted)
  Top 0.508: 43.05,38.87 C2.2 | BOOST.2 43.05,39.53 43.05,38.87 | 48.26,37.87 47.26,38.87 43.05,38.87 | 48.26,37.87 HM3.1 | 57.47,41.35 53.99,37.87 48.26,37.87 | 19.48,43.59 v19.48,46.02 | 19.48,43.59 19.69,43.59 20.29,42.99 IC1.3 22.06,42.99 24.16,40.89 28.22,40.89 | 7.98,42.58 18.48,42.58 19.48,43.59 | 4.45,36.82 4.61,36.82 5.29,37.5 CC0.GND@1 7.98,37.5 7.98,42.58 | 4.45,36.82 3.71,36.82 3.59,36.94 X5.GND@4 | 4.45,36.82 4.45,31.87 | 7.98,42.58 CC0.GND@2 5,42.58 4.45,42.03 X5.GND@3 | REG2.OUT- 36.51,45.25 35.32,44.06 31.38,44.06 28.22,40.89 | 28.22,40.89 IC2.1 28.22,38.03 29.27,36.98 C6.1 28.14,35.95 28.14,35.16 26.98,34 CC0.GND@0 | 4.45,31.87 4.45,30.59 M1.J6.2 6.35,20.4 v10.92,15.82 | X2.GND@3 4.45,31.87 | v38.53,39.95 39.5,38.98 C4.1 | 52.19,22.09 52.2,22.1 52.2,22.34 JP1.2 | OPT.2 49.41,21.19 51.29,21.19 52.19,22.09 | 52.19,22.09 53.34,20.94 JP1.1 | JP1.4 55.34,29.42 62.77,29.42 NMODULE.9 | 17.33,6.35 17.33,9.02 X1.5 | X3.5 17.33,6.18 17.33,6.35 | 17.33,6.35 22.22,6.35 22.73,5.83 I2C-1.2 | 57.47,41.35 57.47,41.94 59.09,41.94 60.82,43.66 BH1750.2 | ICLUSION.1 57.47,41.35 | 38.09,31.01 39.05,31.98 R2.1 | 38.09,31.01 37.88,31.01 37.69,31.2 REG2.IN- | 38.09,31.01 38.09,27.7 40.35,25.44 REG1.2 | MOTION.2 JP1.3
  Bottom 0.508: v19.48,46.02 19.59,46.12 19.59,46.48 U1.GND_3 | X3.5 15.01,3.86 12.24,3.86 11.43,4.67 M1.J7.9 11.43,15.31 v10.92,15.82 | 15.68,32.48 19.59,32.48 20.53,32.48 | 15.68,32.48 14.21,31.01 RFM69W.GNDB 11.26,31.01 7.08,31.01 6.35,30.28 | 15.68,32.48 14.21,33.96 14.21,34.85 RFM69W.GNDA 12,34.85 11.26,34.85 10.26,33.85 8.99,33.85 8.35,34.48 U1.GND_1 4.45,36.51 4.45,36.94 X5.GND@4 0.72,38.25 0.72,40.72 X5.GND@3 | C3.- 37.81,39.71 38.05,39.95 v38.53,39.95 38.53,40.02 40.19,41.67 | 40.19,41.67 36.61,45.25 36.51,45.25 REG2.OUT- | BOOST.2 40.19,41.67 | 6.35,30.28 6.03,30.28 4.45,31.87 X2.GND@3 | M1.J6.2 6.35,30.28 | I2C-1.2 23.88,4.69 24.59,4.69 25.02,4.26 25.02,3.36 27.46,0.92 29.44,0.92 30.06,1.55 30.06,2.66 C1.2 31.25,5.52 | HM3.1 48.26,31.26 42.43,25.44 REG1.2 41.39,24.39 41.91,23.87 I2C-2.2 43.05,17.99 43.05,17.28 43.48,16.85 45.39,16.85 46.19,17.64 46.19,20.27 OPT.2 | JP1.4 JP1.3 JP1.2 | RS485.5 20.93,16.62 20.43,16.13 18.73,16.13 | R6.2 18.73,16.13 | X1.5 17.86,11.71 17.86,15.26 18.73,16.13 | I2C..4 57.15,11.55 | 57.15,11.55 C15.1 C30.2 54.36,11.55 53.34,11.55 | 57.15,11.55 | 53.34,11.55 53.02,11.55 D7.4 49.66,11.55 C28.2 C29.2 46.99,11.55 | 53.34,11.55 HM1.2 JP1.1 | 46.99,11.55 A0.4 43.18,11.55 42.67,11.04 C16.1 C27.2 40.51,11.04 40.01,11.55 UART.4 | 46.99,11.55 | C10.1 24.45,24.74 23.9,24.74 20.43,28.22 20.43,32.38 20.53,32.48 | U1.GND_2 20.53,32.48 | C5.2 31.4,9.39 32.13,8.66 32.13,5.95 31.7,5.52 31.25,5.52 | STEPUP.3 31.25,5.52
  other vias: 8.89,43.93 17.78,36.94 17.14,44.56 49.53,45.2 52.7,44.56 57.78,45.83 58.42,38.22 54.61,36.31 57.78,35.67 43.18,22.34 55.88,7.1 40.64,4.56 19.05,2.02 14.61,2.02 6.99,2.02 8.26,24.88 8.26,24.88 15.24,38.22
  pour Top: 0.64,47.11 0.64,0.75 64.77,0.75 64.77,47.11
  pour Bottom: 64.77,0.75 0.64,0.75 0.64,47.11 64.77,47.11
IN  (via drill 0.3 pad 0.61)
  Top 0.508: v28.82,26.37 22.24,26.37 20.32,28.29 20.32,29.07 18.27,31.13 v16.54,31.13 | X3.1 X1.1
  Bottom 0.508: F1.P$2 40.59,32.45 36.31,28.16 36.31,21.73 35.62,21.05 33.63,21.05 33.14,21.54 33.14,23.87 32.13,24.88 30.31,24.88 v28.82,26.37 | X1.1 1.81,10.54 1.81,28.33 3.33,29.85 4.26,29.85 5.08,29.03 5.08,28.26 5.82,27.52 9.32,27.52 10.03,28.22 10.03,28.89 11.03,29.9 15.31,29.9 v16.54,31.13
IRQ  (via drill 0.3 pad 0.61)
  Top 0.305: NMODULE.5 63.5,18.06 61.47,16.03 59.93,16.03 59.86,16.1 59.38,16.1 59.31,16.03 49.26,16.03 48.83,15.61 34.78,15.61 33.27,17.12 32.78,17.12 32.69,17.02 28.82,17.02 v28.52,17.32 28.41,17.2 20.43,17.2 | v9.87,35.58 9.3,35.02 9.3,30.73 10.17,29.86 10.17,25.92 18.6,17.49 20.15,17.49 20.43,17.2 | M1.J7.8 16.84,16.32 20.08,16.32 20.43,16.67 20.43,17.2 | v27.04,43.84 26.88,44 CC0.GDO0
  Bottom 0.305: RS485.2 28.5,19.16 28.5,18.53 27.86,17.9 | 27.86,17.9 28.5,17.9 28.5,17.34 v28.52,17.32 | RS485.3 27.86,17.9 | 9.79,42.25 9.87,42.18 v9.87,35.58 | U1.DIO0 9.56,42.48 9.79,42.25 | 9.79,42.25 11.95,44.41 15.09,44.41 18.07,47.39 23.49,47.39 v27.04,43.84 30.4,43.84 31.01,43.23 RFM69W.DIO0
MISO  (via drill 0.3 pad 0.61)  (1 unrouted)
  Top 0.305: v27.04,39.76 26.88,39.76 | 26.88,39.76 26.88,40 CC0.MISO | M1.J6.10 24.39,30.97 24.39,34.54 24.53,34.69 26.15,34.69 26.88,35.42 26.88,39.76
  Bottom 0.305: U1.MISO 23.25,44.48 23.25,43.55 v27.04,39.76 | RFM69W.MISO 11.36,39.01 11.36,36.28 11.76,35.89 14.2,35.89 15.83,34.26 22.26,34.26 23.25,33.27 23.25,29.48 23.06,29.29 23.06,28.24 23.72,27.59 25.57,27.59 M1.J6.10
MOSI  (1 unrouted)
  Top 0.305: CC0.MOSI 24.39,36 23.91,35.52 23.91,30.4 25.4,28.91 25.4,28.47 26.21,27.65 28.17,27.65 M1.J6.11
  Bottom 0.305: M1.J6.11 27.7,30.2 27.7,38.03 23.25,42.48 U1.MOSI 15.58,42.48 14.11,41.01 RFM69W.MOSI
N$13
  Bottom 0.305: STEPUP.5 27.67,6.47 27.67,6.44 27.3,6.07 L1.2
RAW
  Bottom 0.508: RAW.1 M1.J6.1
RX
  Top 0.305: UART.1 36.3,3.92 35.86,4.36 35.86,9.67 33.56,11.97 7.83,11.97 M1.J7.11
SCK  (1 unrouted)
  Top 0.305: CC0.SCLK 24.39,38 23.48,37.09 23.48,29.34 M1.J6.9
  Bottom 0.305: 23.25,35.59 24.13,34.71 M1.J6.9 | 23.25,35.59 15.52,35.59 14.11,37.01 RFM69W.SCK | 23.25,35.59 23.25,40.48 U1.SCK
TX
  Top 0.305: M1.J7.12 4.89,14.53 11.87,14.53 12.7,13.7 12.7,13.23 13.52,12.42 14.43,12.42 15.35,13.34 15.35,13.76 16.91,15.31 32.1,15.31 36.51,10.9 36.51,10.07 36.3,9.85 36.3,6.47 UART.2
UREG  (via drill 0.3 pad 0.61)
  Top 0.508: IC2.3 32.79,38.13 32.18,38.13 v32.09,38.03 | X3.2 7.02,6.37 9.73,6.37 12.24,3.87 21.21,3.87 21.78,4.43 27.02,4.43 v33.6,11.01 | 44,36.25 42.13,36.25 40.96,37.42 40.96,39.09 BOOST.1 | HM1.1 50.24,14.16 v44.11,14.16 | 44,36.25 44.67,36.92 44.67,37.58 C2.1 | 44.65,33.77 44.65,35.6 44,36.25 | 44.65,33.77 45.16,33.77 45.16,32.87 45.66,32.38 45.66,31.35 REG2.IN+ 46.84,31.2 46.91,31.12 63.39,31.12 NMODULE.10 | R1.1 44.65,33.77
  Bottom 0.508: BOOST.1 38.03,42.02 31.14,42.02 30.91,41.79 30.91,38.32 31.19,38.03 v32.09,38.03 | v33.6,11.01 34.02,11.01 40.64,17.63 | X3.2 X1.2 5.51,10.1 2.46,13.14 2.46,21.35 3.42,22.3 5.33,22.3 RAW.2 | 40.64,17.63 v44.11,14.16 | 40.23,27.34 40.23,24.65 40.64,24.24 40.64,17.63 | 40.23,27.34 40.35,27.34 40.39,27.34 41.16,27.34 45.02,31.2 | REG1.3 40.23,27.34 | REG2.IN+ 45.02,31.2 | 45.02,31.2 45.02,32.34 44.91,32.45 F1.P$1
VCC  (via drill 0.3 pad 0.61)
  Top 0.508: BOOST.3 43.04,41.67 41.82,42.9 32.51,42.9 30.5,40.89 IC2.2 30.5,39.41 30.5,38.13 30.4,38.02 30.4,34.05 C6.2 29.27,33.02 29.27,32 | M1.J6.4 11.43,33.01 v9.91,34.53 | A0.3 UART.3 | v48.94,11.95 48.94,10.23 50.16,9.01 D7.3 | 29.27,32 v29.45,32 | 29.27,32 26.31,32 CC0.VCC | REG1.1 43.7,27.34 46.16,24.88 OPT.3 | JP3.3 51.94,24.88 51.94,25.28 52.9,26.23 | JP3.4 51.94,27.42 51.94,27.18 52.9,26.23 | 52.9,26.23 53.83,26.23 54.74,27.13 54.74,27.42 MOTION.1 57.02,27.42 58.39,28.79 61.47,28.79 63.5,26.76 NMODULE.8
  Bottom 0.508: 16.48,22.84 15.18,22.84 12.78,20.44 R8.2 11.74,20.33 10.49,19.07 9.18,19.07 6.24,16.13 3.5,16.13 R3.1 R7.1 | 16.48,22.84 17.01,22.84 18.73,21.13 R5.1 20.29,21.07 20.93,20.44 RS485.8 23.67,20.44 | M1.J6.4 12.56,27.55 15.49,27.55 16.48,26.56 16.48,22.84 | 23.67,21.35 24.14,21.35 25.48,22.69 25.48,24.04 28.86,27.42 32.14,27.42 32.9,28.18 32.9,30.5 RFM69W.VCC 30.91,31.01 30.44,31.01 v29.45,32 | 23.67,21.35 23.67,20.44 | 23.67,21.35 22.55,22.48 C10.2 | U1.3.3V 8.35,40.48 8.35,36.09 v9.91,34.53 | 46.99,9.01 A0.3 44.13,9.01 43.18,9.01 42.67,9.51 C16.2 | 46.99,9.01 C29.1 C28.1 49.66,9.51 50.16,9.01 51.12,9.01 D7.3 54.36,9.01 C30.1 C15.2 57.15,9.01 | 46.99,9.01 | 23.34,7 24.36,7 25.08,6.28 25.08,5.8 25.6,5.28 27.56,5.28 | 22.73,5.1 22.73,6.38 23.34,7 | 23.34,7 20.32,10.02 20.32,10.1 | 20.32,10.1 20.32,13.8 22.36,15.84 23.36,15.84 23.67,16.15 23.67,20.44 | 20.32,10.1 X1.6 | C3.+ 37.81,34.71 37.81,36.03 BOOST.3 44.81,43.04 45.66,43.04 | v48.94,11.95 48.47,12.41 48.47,15.81 50.8,18.14 50.8,18.66 JP3.1 JP3.2 JP3.3 OPT.3 44.45,21.07 I2C-2.1 | 50.8,38.27 46.03,43.04 45.66,43.04 | 50.8,38.27 52.89,38.27 60.82,46.2 BH1750.1 | 50.8,38.27 HM3.2 JP3.4 | 45.66,43.04 45.66,45.25 REG2.OUT+ | UART.3 40.13,9.01 C27.1 | I2C..3 57.15,9.01 | 57.15,9.01 | X3.6 22.73,5.1 | STEPUP.2 30.16,6.47 29.53,5.83 29.53,5.52 STEPUP.4 27.56,5.52 27.56,5.28 | C1.1 28.45,4.39 28.23,4.39 27.56,5.05 27.56,5.28 | I2C-1.1 22.73,4.44 22.73,5.1
VIN
  Bottom 0.305: L1.1 27.3,7.87 27.67,7.5 27.67,7.41 STEPUP.6 28.82,7.41 | 28.82,7.41 STEPUP.1 | 28.82,7.41 28.82,8.51 C5.1

### Text on the board
tPlace: Inclusion | easyMySens V1.0 | by Ranseyer | HM | uni- / versal
tOrigins: G3 | G1 | G1 | G3 | G2 | G1 | G1 | G3 | G3 | Gehäuse 1: Box2252 / Geh2: 59x65 / Gehäuse 3: 67x98
tNames: + | - | IN | - | OUT | - | AMS1117 | SDA | MISO | C4 | C2 | Antenna | ATSHA204A / (MySensors / optional) | SCK | MOSI | 22p | 100nF | 470K | 1M | CC1101 / for / HM | GND | C6 | - | VCC | R2 | R1 | VCC | Mini360 | + | - | UREG | VCC | VCC | + | V+ | IRQ | - | MISO | Reg1 | VCC | - | MOSI | SCK | - | D4 | CSN | - | + | CE /D9 | + | A5 | GND | - | VCC | UREG | SCL | SDA | - | + | GND | GND | GND | - | - | - | - | A2 | SCL | + | VCC | + | VCC | + | VCC | + | IN | A | A1 | TX | A1 | D5 | A4 | A2 | RX | D6 | A5 | UREG | B | GND | VCC | I2C | VCC GND SCL A4/SDA | UART | Analog | Digital | I2C
bNames: - | + | OUT | NSS | MOSI | easySensor / (Standard-V0.2) | MISO | SCK | Fuse1 | GND | C3 10uF | Antenna | - | IN | + | Mini360 | - | VCC | + | R5/6 | 22p | Max487 | 330R | 330R | C1 10uF | Grove Connectors
Milling: Please include the cutouts...